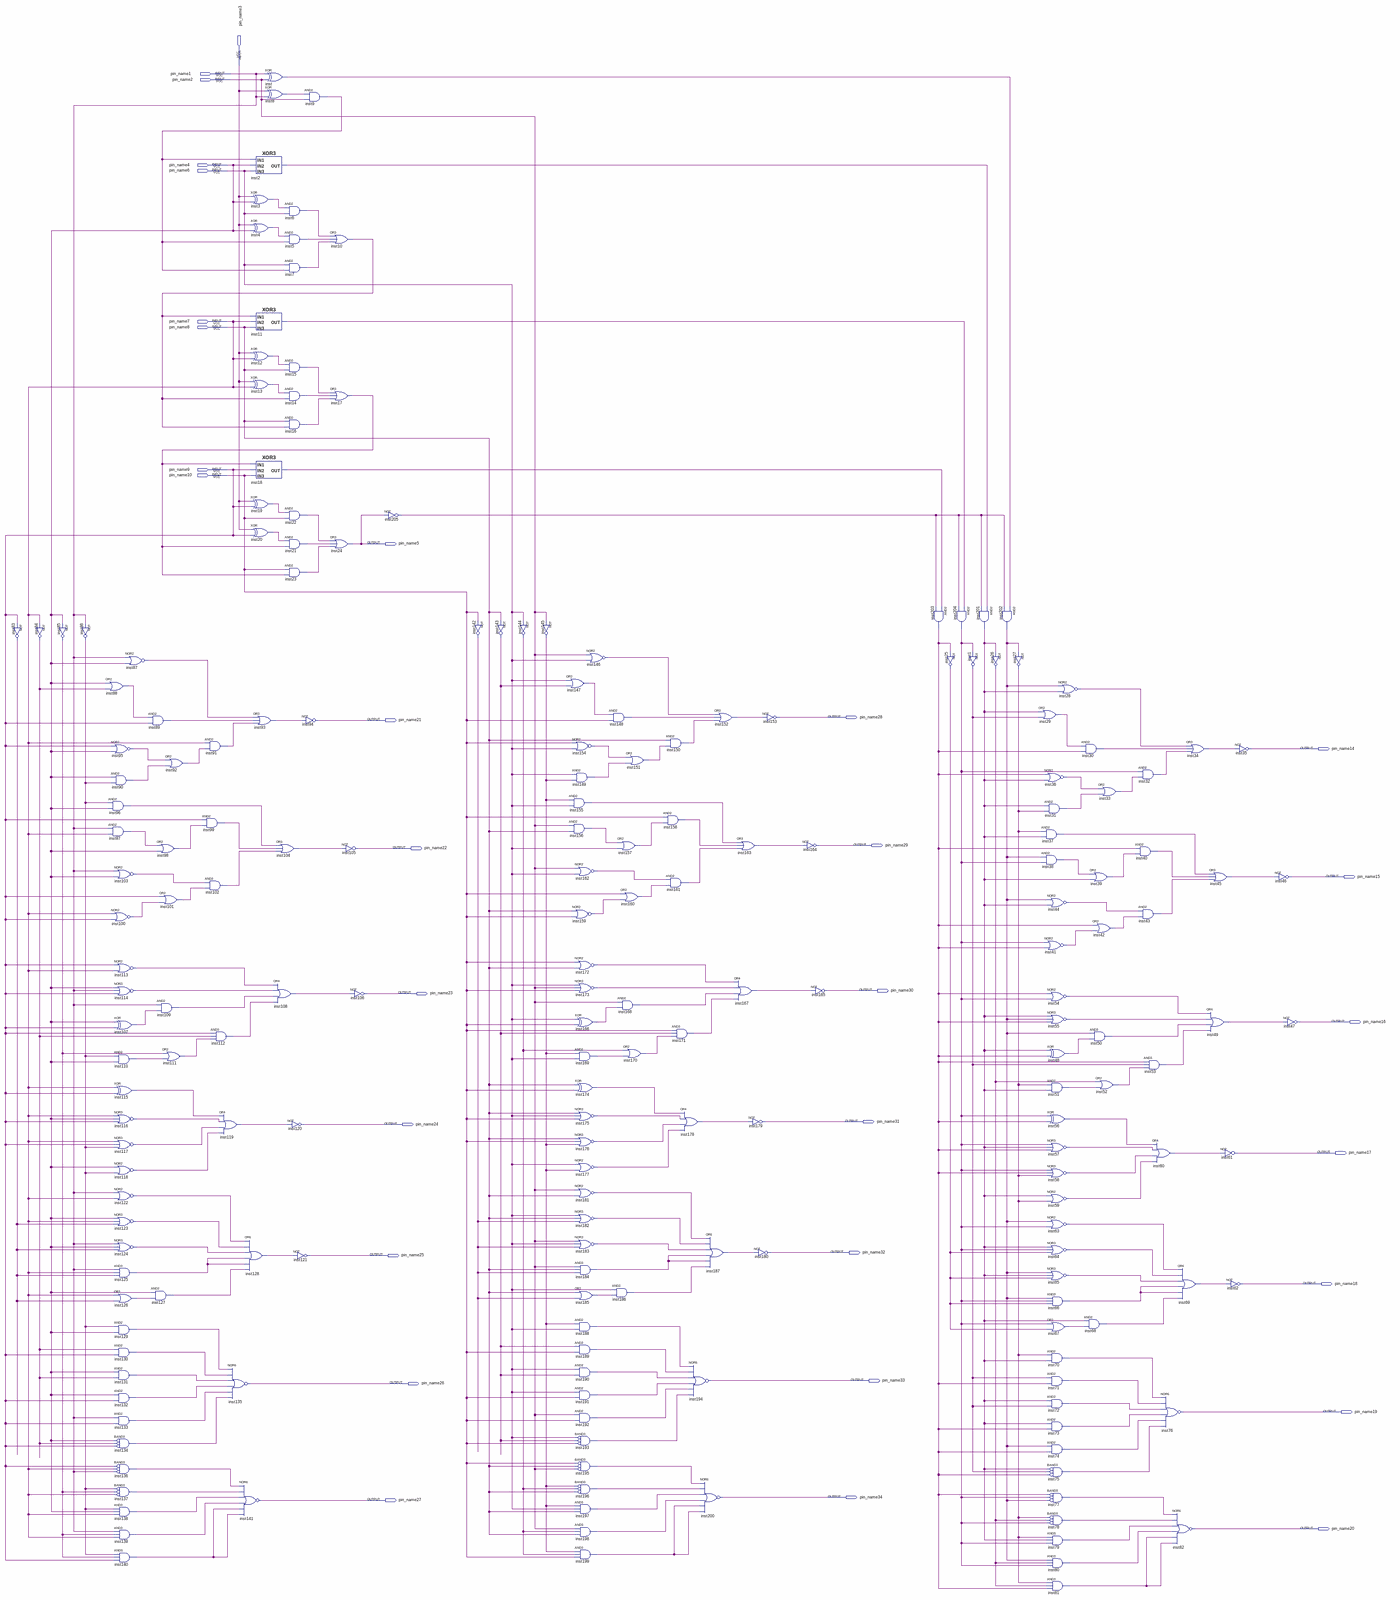
[diagram p0: schematic sheet, whole]
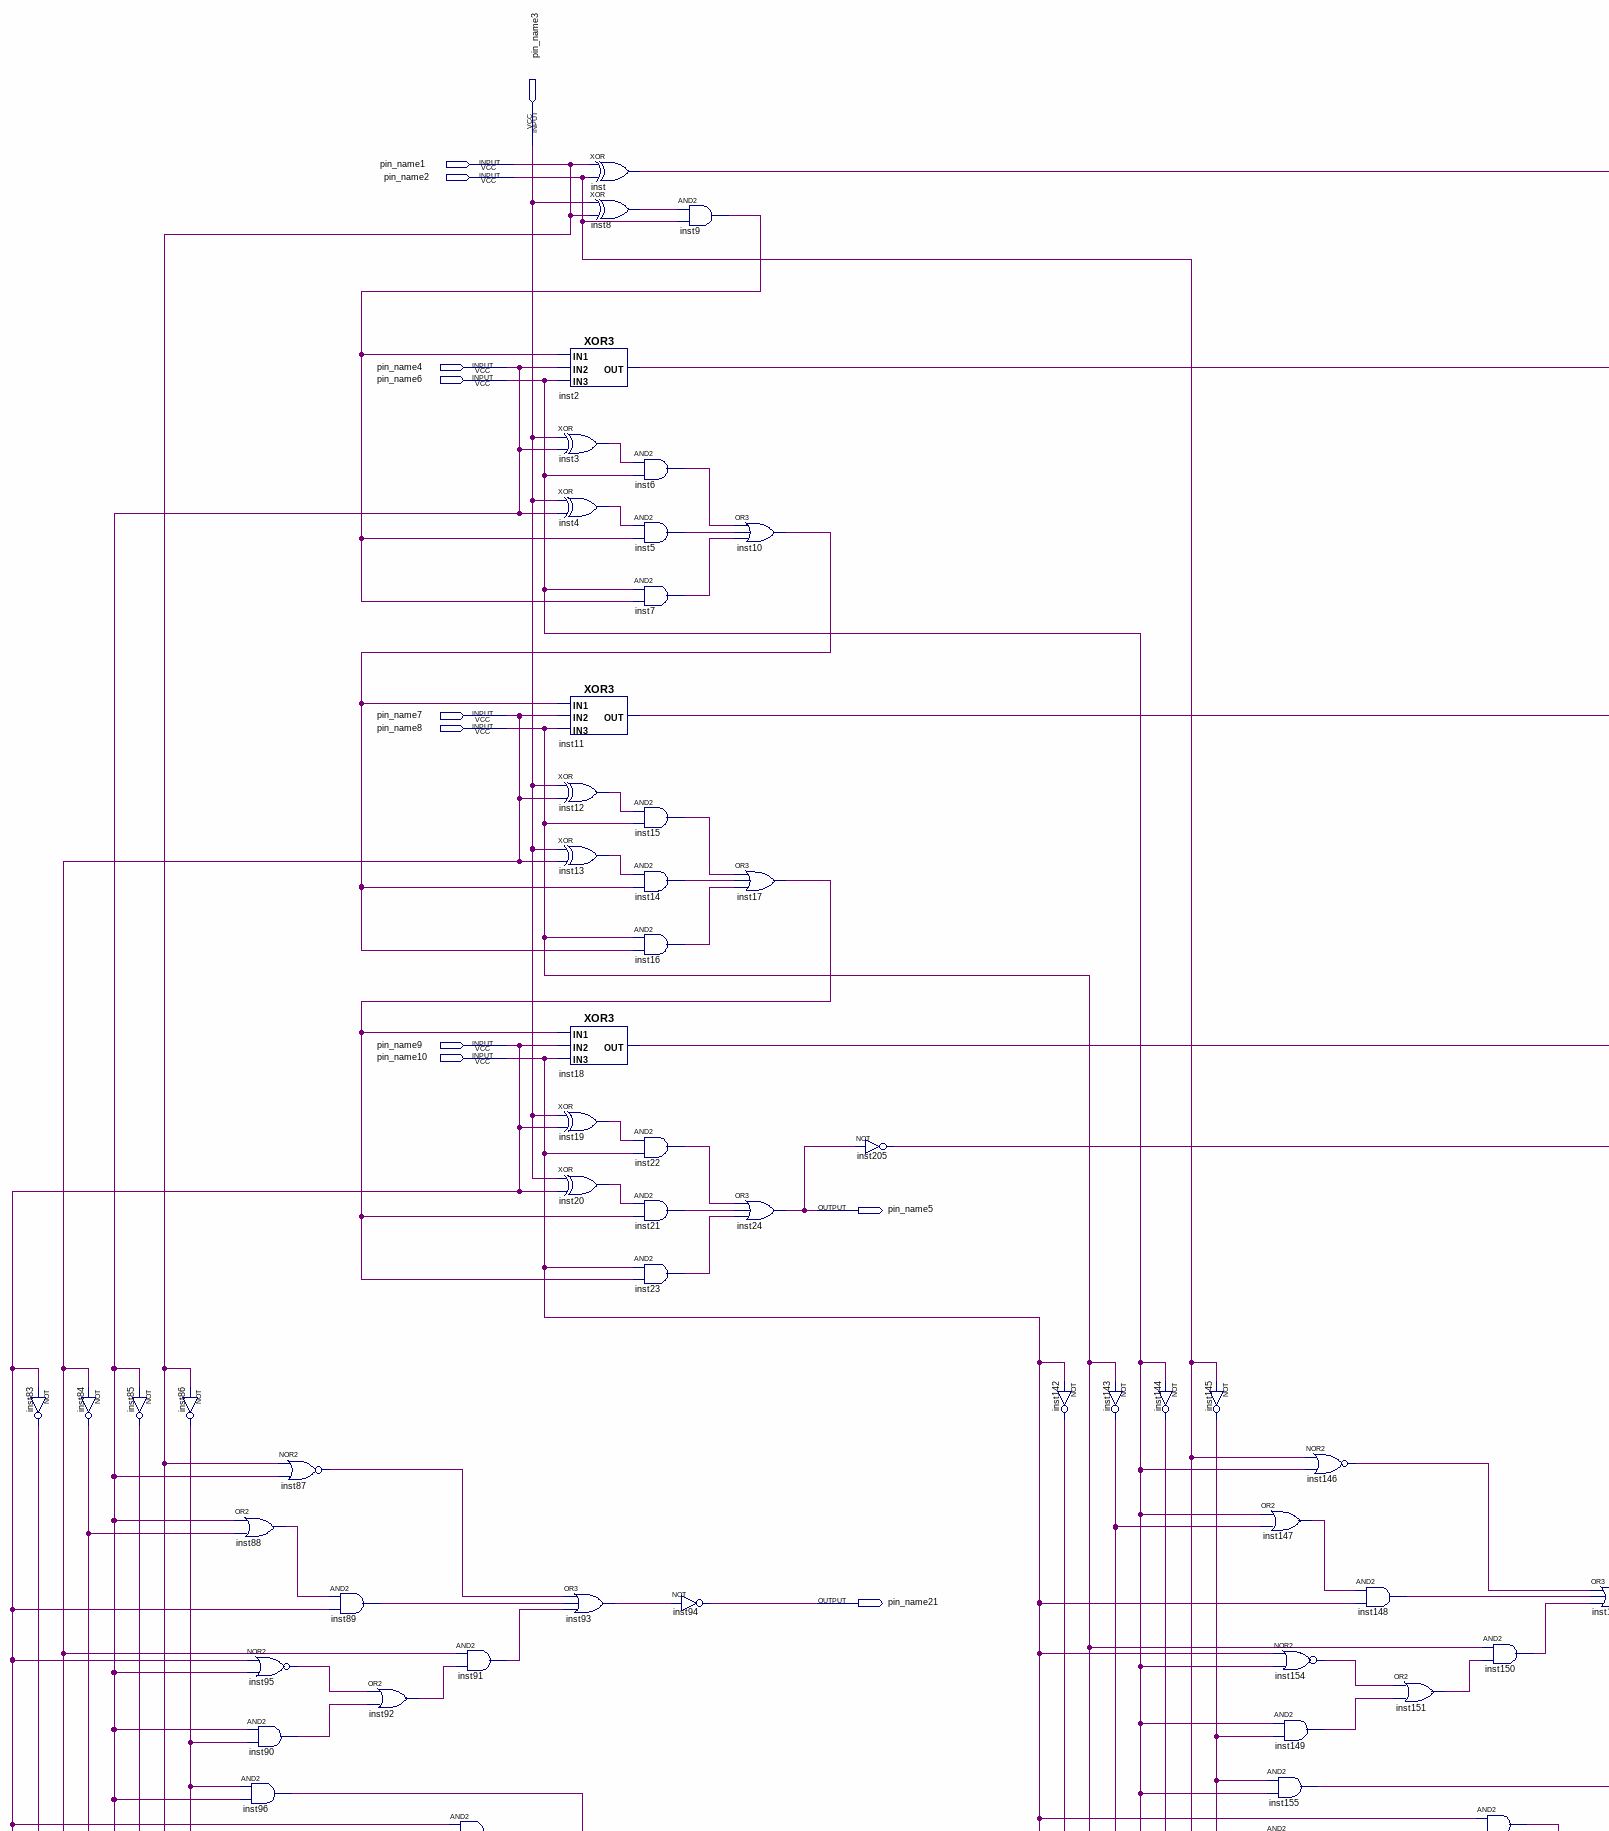
[diagram p1: schematic sheet, upper left part]
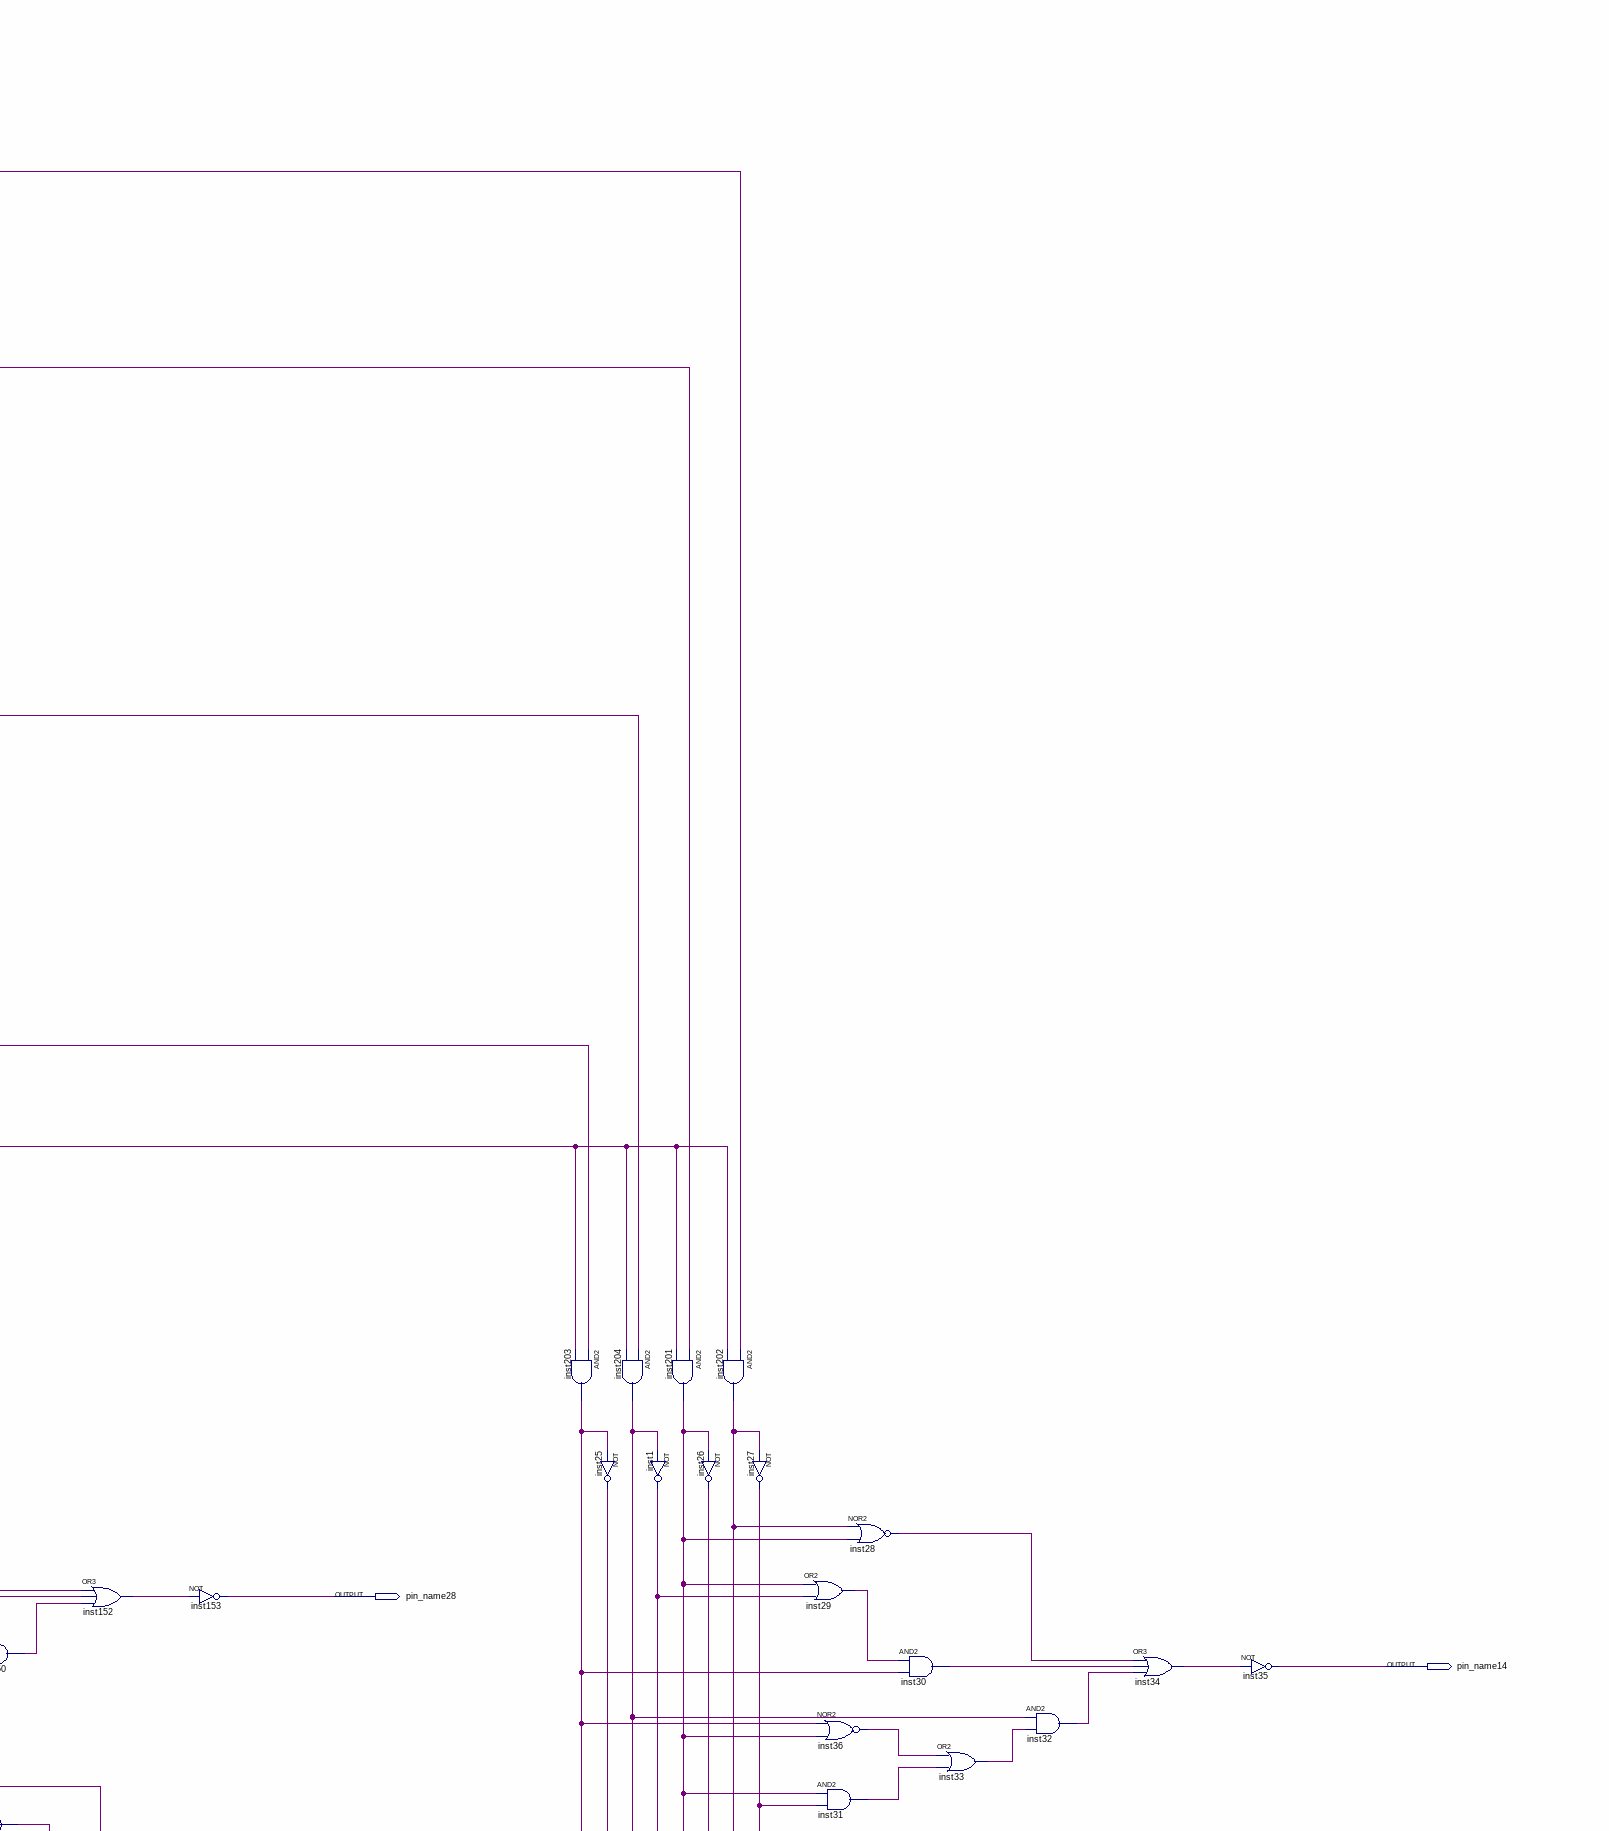
[diagram p2: schematic sheet, upper right part]
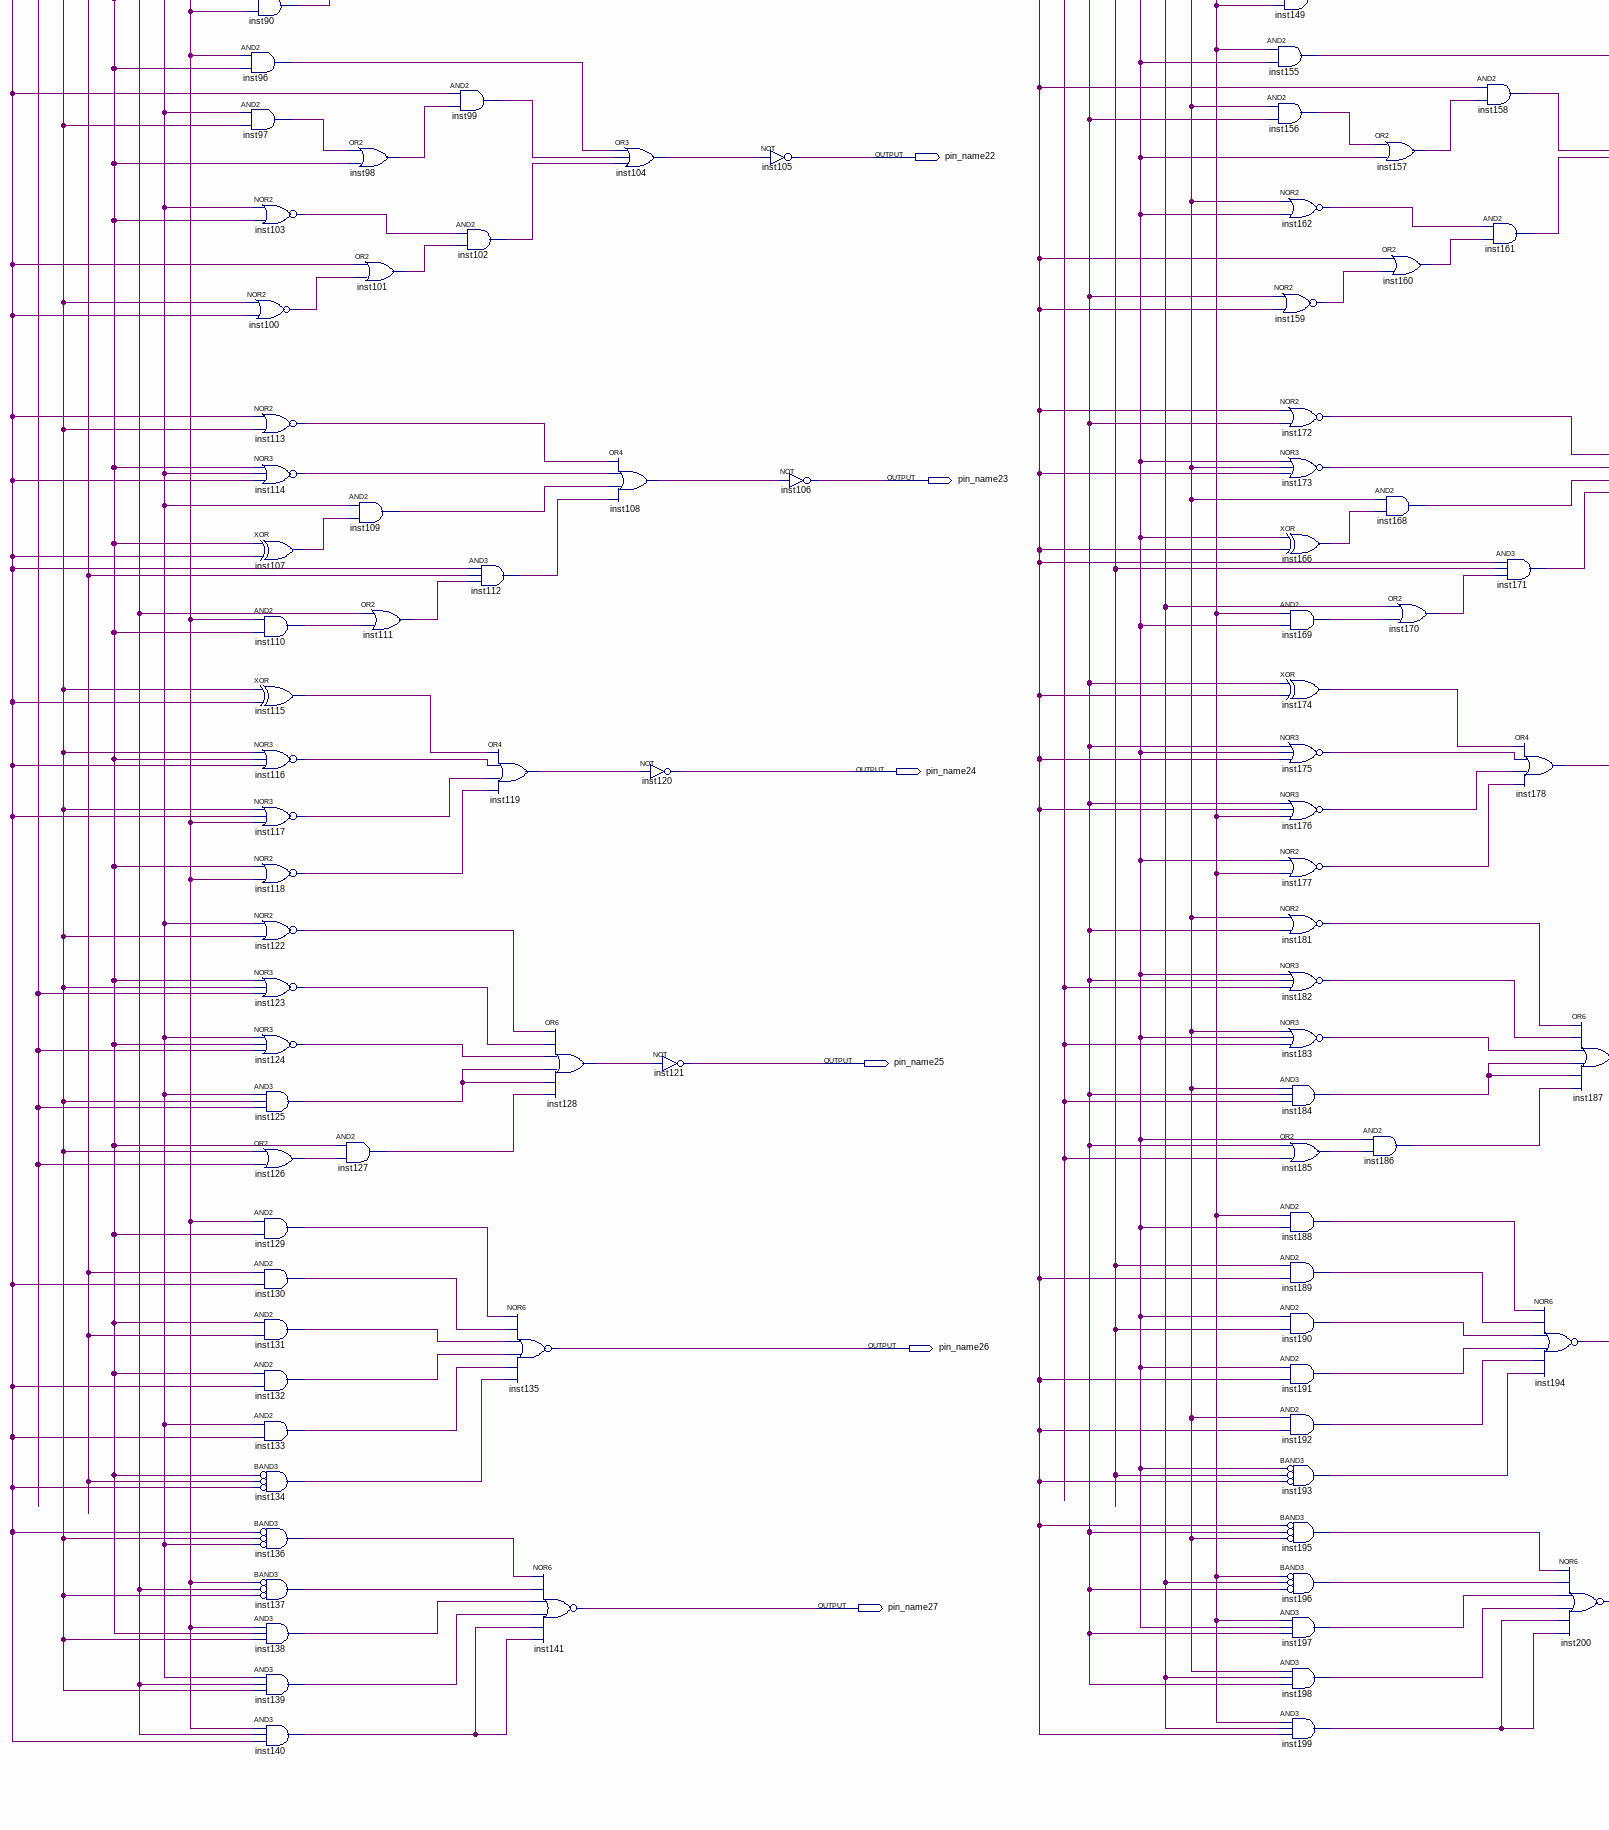
[diagram p3: schematic sheet, lower left part]
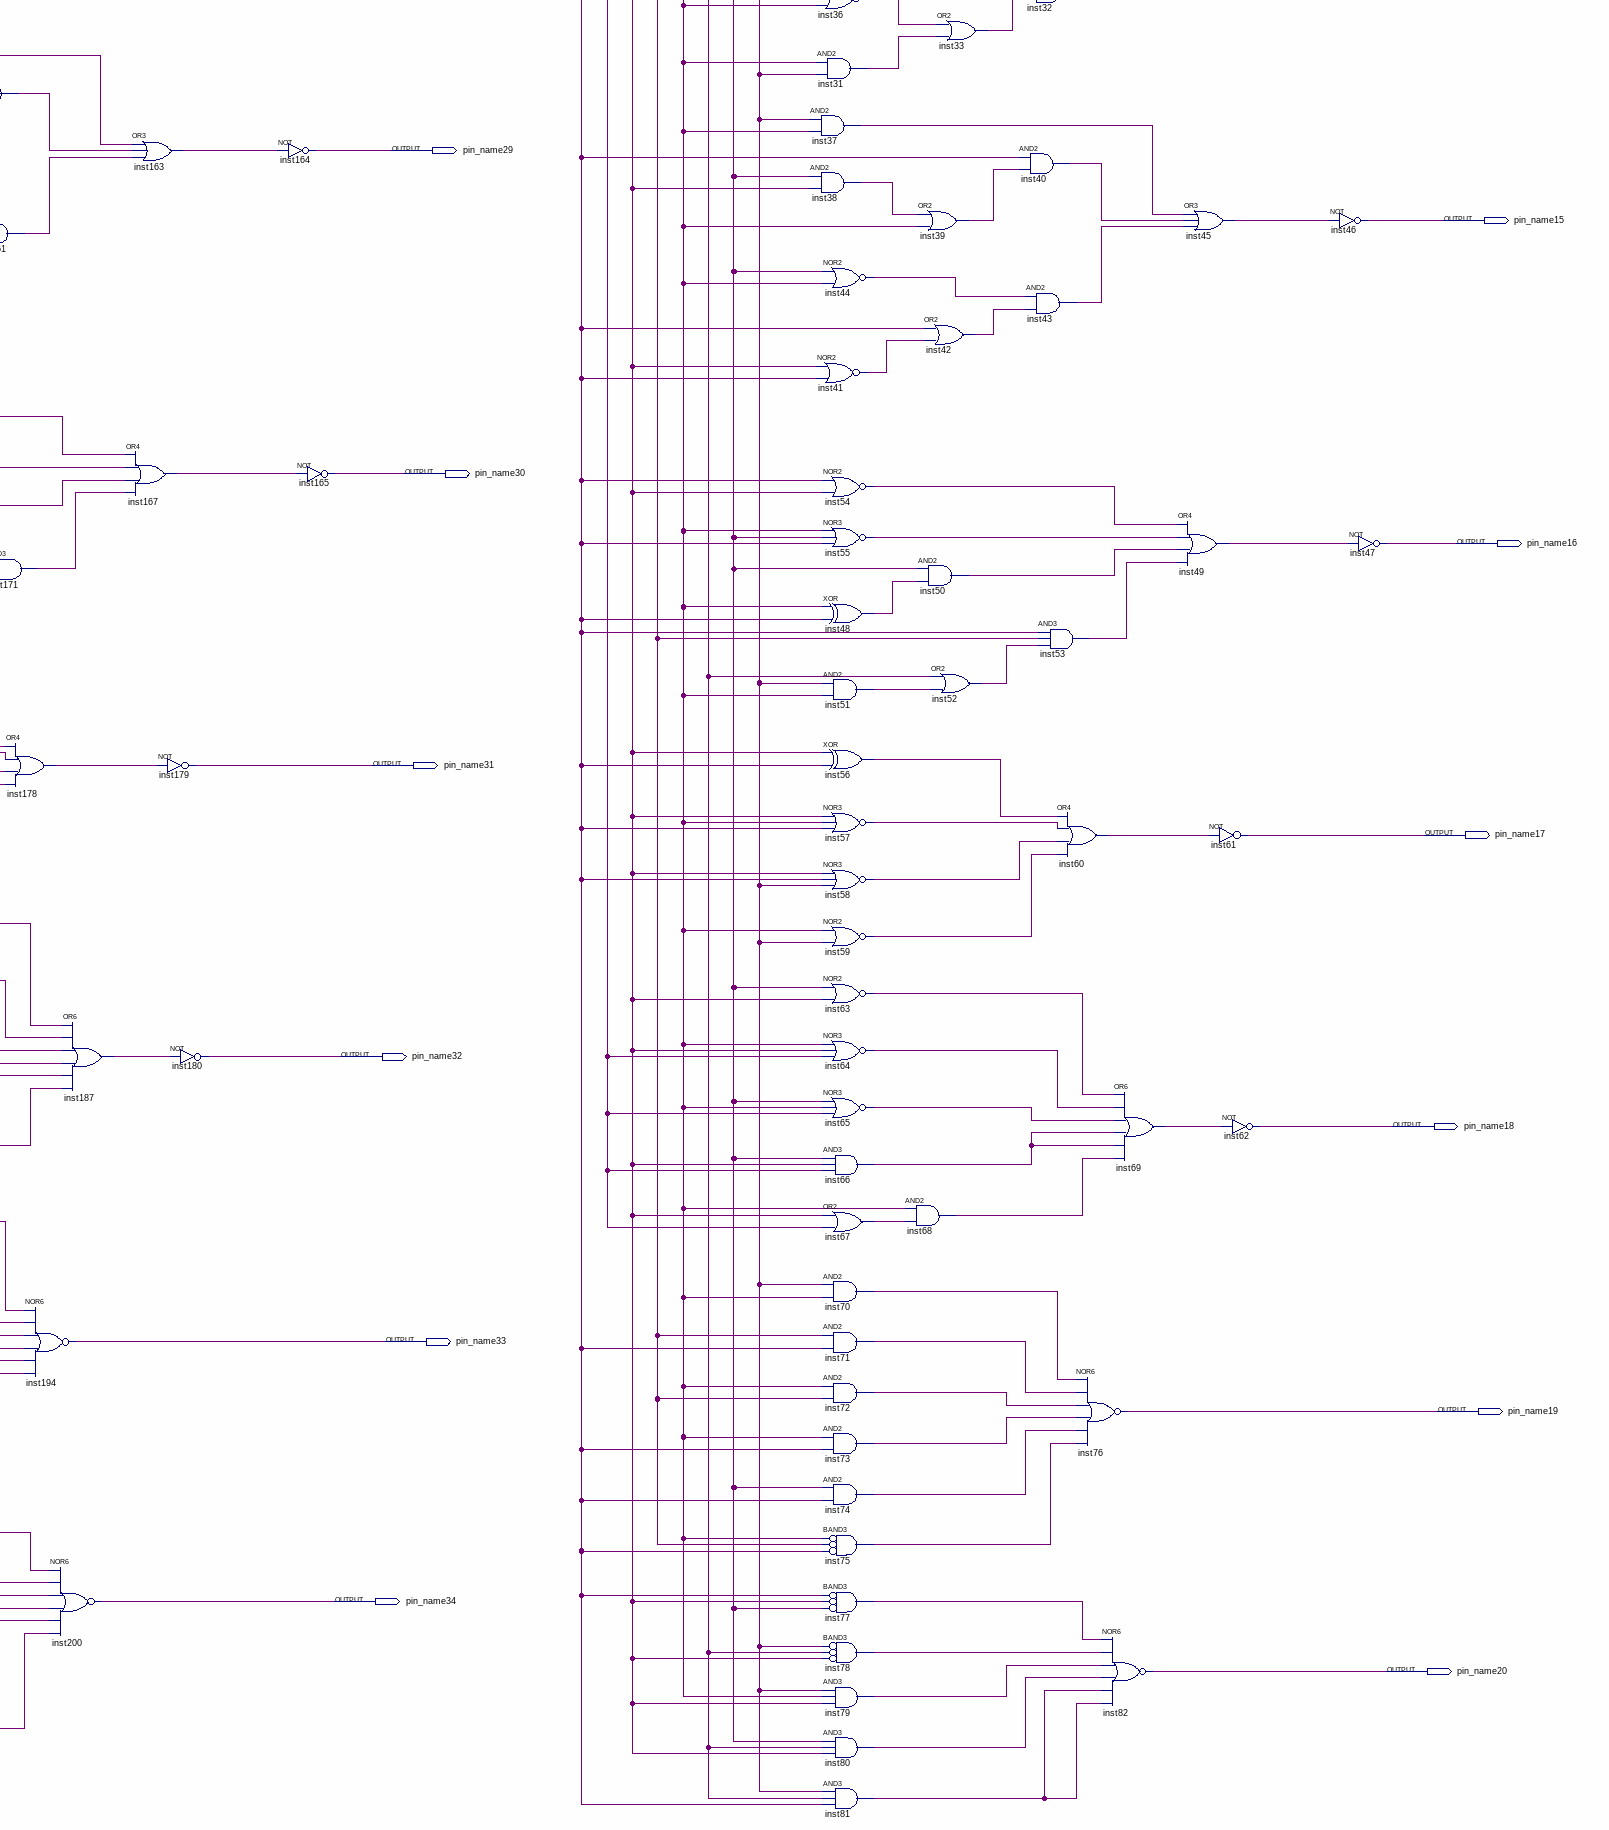
[diagram p4: schematic sheet, lower right part]
// Quartus schematic somador.bdf as structural Verilog: 206 symbols, 31 pins
module somador (
  input  pin_name3,
  input  pin_name1,
  input  pin_name2,
  input  pin_name4,
  input  pin_name6,
  input  pin_name7,
  input  pin_name8,
  input  pin_name9,
  input  pin_name10,
  output pin_name5,
  output pin_name28,
  output pin_name21,
  output pin_name14,
  output pin_name29,
  output pin_name22,
  output pin_name15,
  output pin_name30,
  output pin_name23,
  output pin_name16,
  output pin_name31,
  output pin_name24,
  output pin_name17,
  output pin_name32,
  output pin_name25,
  output pin_name18,
  output pin_name33,
  output pin_name26,
  output pin_name19,
  output pin_name34,
  output pin_name27,
  output pin_name20
);

  wire inst1_out, inst2_out, inst3_out, inst4_out, inst5_out, inst6_out, inst7_out, inst8_out, inst9_out,
       inst10_out, inst11_out, inst12_out, inst13_out, inst14_out, inst15_out, inst16_out, inst17_out,
       inst18_out, inst19_out, inst20_out, inst21_out, inst22_out, inst23_out, inst25_out, inst26_out,
       inst27_out, inst28_out, inst29_out, inst30_out, inst31_out, inst32_out, inst33_out, inst34_out,
       inst36_out, inst37_out, inst38_out, inst39_out, inst40_out, inst41_out, inst42_out, inst43_out,
       inst44_out, inst45_out, inst48_out, inst49_out, inst50_out, inst51_out, inst52_out, inst53_out,
       inst54_out, inst55_out, inst56_out, inst57_out, inst58_out, inst59_out, inst60_out, inst63_out,
       inst64_out, inst65_out, inst66_out, inst67_out, inst68_out, inst69_out, inst70_out, inst71_out,
       inst72_out, inst73_out, inst74_out, inst75_out, inst77_out, inst78_out, inst79_out, inst80_out,
       inst81_out, inst83_out, inst84_out, inst85_out, inst86_out, inst87_out, inst88_out, inst89_out,
       inst90_out, inst91_out, inst92_out, inst93_out, inst95_out, inst96_out, inst97_out, inst98_out,
       inst99_out, inst100_out, inst101_out, inst102_out, inst103_out, inst104_out, inst107_out, inst108_out,
       inst109_out, inst110_out, inst111_out, inst112_out, inst113_out, inst114_out, inst115_out,
       inst116_out, inst117_out, inst118_out, inst119_out, inst122_out, inst123_out, inst124_out,
       inst125_out, inst126_out, inst127_out, inst128_out, inst129_out, inst130_out, inst131_out,
       inst132_out, inst133_out, inst134_out, inst136_out, inst137_out, inst138_out, inst139_out,
       inst140_out, inst142_out, inst143_out, inst144_out, inst145_out, inst146_out, inst147_out,
       inst148_out, inst149_out, inst150_out, inst151_out, inst152_out, inst154_out, inst155_out,
       inst156_out, inst157_out, inst158_out, inst159_out, inst160_out, inst161_out, inst162_out,
       inst163_out, inst166_out, inst167_out, inst168_out, inst169_out, inst170_out, inst171_out,
       inst172_out, inst173_out, inst174_out, inst175_out, inst176_out, inst177_out, inst178_out,
       inst181_out, inst182_out, inst183_out, inst184_out, inst185_out, inst186_out, inst187_out,
       inst188_out, inst189_out, inst190_out, inst191_out, inst192_out, inst193_out, inst195_out,
       inst196_out, inst197_out, inst198_out, inst199_out, inst201_out, inst202_out, inst203_out,
       inst204_out, inst205_out, inst_out;

  not inst83 (inst83_out, pin_name9);
  not inst84 (inst84_out, pin_name7);
  not inst85 (inst85_out, pin_name4);
  not inst86 (inst86_out, pin_name1);
  or inst88 (inst88_out, pin_name4, inst84_out);
  nor inst95 (inst95_out, pin_name9, pin_name4);
  and inst90 (inst90_out, pin_name4, inst86_out);
  and inst96 (inst96_out, inst86_out, pin_name4);
  and inst97 (inst97_out, pin_name1, pin_name7);
  nor inst103 (inst103_out, pin_name1, pin_name4);
  nor inst100 (inst100_out, pin_name7, pin_name9);
  nor inst113 (inst113_out, pin_name9, pin_name7);
  nor inst114 (inst114_out, pin_name4, pin_name1, pin_name9);
  xor inst107 (inst107_out, pin_name4, pin_name9);
  and inst110 (inst110_out, inst86_out, pin_name4);
  xor inst115 (inst115_out, pin_name7, pin_name9);
  nor inst116 (inst116_out, pin_name7, pin_name4, pin_name9);
  nor inst117 (inst117_out, pin_name7, pin_name9, inst86_out);
  nor inst118 (inst118_out, pin_name4, inst86_out);
  nor inst122 (inst122_out, pin_name1, pin_name7);
  nor inst123 (inst123_out, pin_name4, pin_name7, inst83_out);
  nor inst124 (inst124_out, pin_name1, pin_name4, inst83_out);
  and inst125 (inst125_out, pin_name1, pin_name7, inst83_out);
  or inst126 (inst126_out, pin_name7, inst83_out);
  and inst129 (inst129_out, inst86_out, pin_name4);
  and inst130 (inst130_out, inst84_out, pin_name9);
  and inst131 (inst131_out, pin_name4, inst84_out);
  and inst132 (inst132_out, pin_name4, pin_name9);
  and inst133 (inst133_out, pin_name1, pin_name9);
  and inst134 (inst134_out, ~pin_name4, ~inst84_out, ~pin_name9);  // BAND3
  and inst136 (inst136_out, ~pin_name9, ~pin_name7, ~pin_name1);  // BAND3
  and inst137 (inst137_out, ~inst86_out, ~inst85_out, ~pin_name7);  // BAND3
  and inst138 (inst138_out, inst86_out, pin_name4, pin_name7);
  and inst139 (inst139_out, pin_name1, inst85_out, pin_name7);
  and inst140 (inst140_out, inst86_out, inst85_out, pin_name9);
  nor inst87 (inst87_out, pin_name1, pin_name4);
  and inst89 (inst89_out, inst88_out, pin_name9);
  or inst92 (inst92_out, inst95_out, inst90_out);
  or inst98 (inst98_out, inst97_out, pin_name4);
  or inst101 (inst101_out, pin_name9, inst100_out);
  and inst109 (inst109_out, pin_name1, inst107_out);
  or inst111 (inst111_out, inst85_out, inst110_out);
  and inst127 (inst127_out, pin_name4, inst126_out);
  and inst91 (inst91_out, pin_name7, inst92_out);
  and inst99 (inst99_out, pin_name9, inst98_out);
  and inst102 (inst102_out, inst103_out, inst101_out);
  and inst112 (inst112_out, pin_name9, inst84_out, inst111_out);
  or inst119 (inst119_out, inst115_out, inst116_out, inst117_out, inst118_out);
  nor inst135 (pin_name26, inst129_out, inst130_out, inst131_out, inst132_out, inst133_out, inst134_out);
  XOR3 inst2 (.IN3(pin_name6), .IN1(inst9_out), .IN2(pin_name4), .OUT(inst2_out));
  xor inst3 (inst3_out, pin_name3, pin_name4);
  xor inst4 (inst4_out, pin_name3, pin_name4);
  XOR3 inst11 (.IN3(pin_name8), .IN1(inst10_out), .IN2(pin_name7), .OUT(inst11_out));
  xor inst12 (inst12_out, pin_name3, pin_name7);
  xor inst13 (inst13_out, pin_name3, pin_name7);
  XOR3 inst18 (.IN3(pin_name10), .IN1(inst17_out), .IN2(pin_name9), .OUT(inst18_out));
  xor inst19 (inst19_out, pin_name3, pin_name9);
  xor inst20 (inst20_out, pin_name3, pin_name9);
  or inst93 (inst93_out, inst87_out, inst89_out, inst91_out);
  or inst128 (inst128_out, inst122_out, inst123_out, inst124_out, inst125_out, inst125_out, inst127_out);
  nor inst141 (pin_name27, inst136_out, inst137_out, inst138_out, inst139_out, inst140_out, inst140_out);
  xor inst (inst_out, pin_name1, pin_name2);
  xor inst8 (inst8_out, pin_name3, pin_name1);
  or inst104 (inst104_out, inst96_out, inst99_out, inst102_out);
  or inst108 (inst108_out, inst113_out, inst114_out, inst109_out, inst112_out);
  and inst6 (inst6_out, inst3_out, pin_name6);
  and inst5 (inst5_out, inst4_out, inst9_out);
  and inst7 (inst7_out, pin_name6, inst9_out);
  and inst15 (inst15_out, inst12_out, pin_name8);
  and inst14 (inst14_out, inst13_out, inst10_out);
  and inst16 (inst16_out, pin_name8, inst10_out);
  and inst22 (inst22_out, inst19_out, pin_name10);
  and inst21 (inst21_out, inst20_out, inst17_out);
  and inst23 (inst23_out, pin_name10, inst17_out);
  not inst94 (pin_name21, inst93_out);
  not inst120 (pin_name24, inst119_out);
  not inst121 (pin_name25, inst128_out);
  and inst9 (inst9_out, inst8_out, pin_name2);
  or inst10 (inst10_out, inst6_out, inst5_out, inst7_out);
  or inst17 (inst17_out, inst15_out, inst14_out, inst16_out);
  or inst24 (pin_name5, inst22_out, inst21_out, inst23_out);
  not inst105 (pin_name22, inst104_out);
  not inst106 (pin_name23, inst108_out);
  not inst205 (inst205_out, pin_name5);
  not inst142 (inst142_out, pin_name10);
  not inst143 (inst143_out, pin_name8);
  not inst144 (inst144_out, pin_name6);
  not inst145 (inst145_out, pin_name2);
  or inst147 (inst147_out, pin_name6, inst143_out);
  nor inst154 (inst154_out, pin_name10, pin_name6);
  and inst149 (inst149_out, pin_name6, inst145_out);
  and inst155 (inst155_out, inst145_out, pin_name6);
  and inst156 (inst156_out, pin_name2, pin_name8);
  nor inst162 (inst162_out, pin_name2, pin_name6);
  nor inst159 (inst159_out, pin_name8, pin_name10);
  nor inst172 (inst172_out, pin_name10, pin_name8);
  nor inst173 (inst173_out, pin_name6, pin_name2, pin_name10);
  xor inst166 (inst166_out, pin_name6, pin_name10);
  and inst169 (inst169_out, inst145_out, pin_name6);
  xor inst174 (inst174_out, pin_name8, pin_name10);
  nor inst175 (inst175_out, pin_name8, pin_name6, pin_name10);
  nor inst176 (inst176_out, pin_name8, pin_name10, inst145_out);
  nor inst177 (inst177_out, pin_name6, inst145_out);
  nor inst181 (inst181_out, pin_name2, pin_name8);
  nor inst182 (inst182_out, pin_name6, pin_name8, inst142_out);
  nor inst183 (inst183_out, pin_name2, pin_name6, inst142_out);
  and inst184 (inst184_out, pin_name2, pin_name8, inst142_out);
  or inst185 (inst185_out, pin_name8, inst142_out);
  and inst188 (inst188_out, inst145_out, pin_name6);
  and inst189 (inst189_out, inst143_out, pin_name10);
  and inst190 (inst190_out, pin_name6, inst143_out);
  and inst191 (inst191_out, pin_name6, pin_name10);
  and inst192 (inst192_out, pin_name2, pin_name10);
  and inst193 (inst193_out, ~pin_name6, ~inst143_out, ~pin_name10);  // BAND3
  and inst195 (inst195_out, ~pin_name10, ~pin_name8, ~pin_name2);  // BAND3
  and inst196 (inst196_out, ~inst145_out, ~inst144_out, ~pin_name8);  // BAND3
  and inst197 (inst197_out, inst145_out, pin_name6, pin_name8);
  and inst198 (inst198_out, pin_name2, inst144_out, pin_name8);
  and inst199 (inst199_out, inst145_out, inst144_out, pin_name10);
  nor inst146 (inst146_out, pin_name2, pin_name6);
  and inst148 (inst148_out, inst147_out, pin_name10);
  or inst157 (inst157_out, inst156_out, pin_name6);
  or inst160 (inst160_out, pin_name10, inst159_out);
  and inst168 (inst168_out, pin_name2, inst166_out);
  and inst186 (inst186_out, pin_name6, inst185_out);
  or inst151 (inst151_out, inst154_out, inst149_out);
  or inst170 (inst170_out, inst144_out, inst169_out);
  and inst150 (inst150_out, pin_name8, inst151_out);
  and inst158 (inst158_out, pin_name10, inst157_out);
  and inst161 (inst161_out, inst162_out, inst160_out);
  and inst171 (inst171_out, pin_name10, inst143_out, inst170_out);
  or inst178 (inst178_out, inst174_out, inst175_out, inst176_out, inst177_out);
  nor inst194 (pin_name33, inst188_out, inst189_out, inst190_out, inst191_out, inst192_out, inst193_out);
  or inst187 (inst187_out, inst181_out, inst182_out, inst183_out, inst184_out, inst184_out, inst186_out);
  nor inst200 (pin_name34, inst195_out, inst196_out, inst197_out, inst198_out, inst199_out, inst199_out);
  or inst152 (inst152_out, inst146_out, inst148_out, inst150_out);
  or inst167 (inst167_out, inst172_out, inst173_out, inst168_out, inst171_out);
  or inst163 (inst163_out, inst155_out, inst158_out, inst161_out);
  not inst179 (pin_name31, inst178_out);
  not inst180 (pin_name32, inst187_out);
  not inst153 (pin_name28, inst152_out);
  not inst164 (pin_name29, inst163_out);
  not inst165 (pin_name30, inst167_out);
  and inst203 (inst203_out, inst18_out, inst205_out);
  and inst204 (inst204_out, inst11_out, inst205_out);
  not inst25 (inst25_out, inst203_out);
  and inst201 (inst201_out, inst2_out, inst205_out);
  not inst1 (inst1_out, inst204_out);
  and inst202 (inst202_out, inst_out, inst205_out);
  not inst26 (inst26_out, inst201_out);
  not inst27 (inst27_out, inst202_out);
  or inst29 (inst29_out, inst201_out, inst1_out);
  nor inst36 (inst36_out, inst203_out, inst201_out);
  and inst31 (inst31_out, inst201_out, inst27_out);
  and inst37 (inst37_out, inst27_out, inst201_out);
  and inst38 (inst38_out, inst202_out, inst204_out);
  nor inst44 (inst44_out, inst202_out, inst201_out);
  nor inst41 (inst41_out, inst204_out, inst203_out);
  nor inst54 (inst54_out, inst203_out, inst204_out);
  nor inst55 (inst55_out, inst201_out, inst202_out, inst203_out);
  xor inst48 (inst48_out, inst201_out, inst203_out);
  and inst51 (inst51_out, inst27_out, inst201_out);
  xor inst56 (inst56_out, inst204_out, inst203_out);
  nor inst57 (inst57_out, inst204_out, inst201_out, inst203_out);
  nor inst58 (inst58_out, inst204_out, inst203_out, inst27_out);
  nor inst59 (inst59_out, inst201_out, inst27_out);
  nor inst63 (inst63_out, inst202_out, inst204_out);
  nor inst64 (inst64_out, inst201_out, inst204_out, inst25_out);
  nor inst65 (inst65_out, inst202_out, inst201_out, inst25_out);
  and inst66 (inst66_out, inst202_out, inst204_out, inst25_out);
  or inst67 (inst67_out, inst204_out, inst25_out);
  and inst70 (inst70_out, inst27_out, inst201_out);
  and inst71 (inst71_out, inst1_out, inst203_out);
  and inst72 (inst72_out, inst201_out, inst1_out);
  and inst73 (inst73_out, inst201_out, inst203_out);
  and inst74 (inst74_out, inst202_out, inst203_out);
  and inst75 (inst75_out, ~inst201_out, ~inst1_out, ~inst203_out);  // BAND3
  and inst77 (inst77_out, ~inst203_out, ~inst204_out, ~inst202_out);  // BAND3
  and inst78 (inst78_out, ~inst27_out, ~inst26_out, ~inst204_out);  // BAND3
  and inst79 (inst79_out, inst27_out, inst201_out, inst204_out);
  and inst80 (inst80_out, inst202_out, inst26_out, inst204_out);
  and inst81 (inst81_out, inst27_out, inst26_out, inst203_out);
  nor inst28 (inst28_out, inst202_out, inst201_out);
  and inst30 (inst30_out, inst29_out, inst203_out);
  or inst33 (inst33_out, inst36_out, inst31_out);
  or inst39 (inst39_out, inst38_out, inst201_out);
  or inst42 (inst42_out, inst203_out, inst41_out);
  and inst50 (inst50_out, inst202_out, inst48_out);
  or inst52 (inst52_out, inst26_out, inst51_out);
  and inst68 (inst68_out, inst201_out, inst67_out);
  and inst32 (inst32_out, inst204_out, inst33_out);
  and inst40 (inst40_out, inst203_out, inst39_out);
  and inst43 (inst43_out, inst44_out, inst42_out);
  and inst53 (inst53_out, inst203_out, inst1_out, inst52_out);
  or inst60 (inst60_out, inst56_out, inst57_out, inst58_out, inst59_out);
  nor inst76 (pin_name19, inst70_out, inst71_out, inst72_out, inst73_out, inst74_out, inst75_out);
  or inst34 (inst34_out, inst28_out, inst30_out, inst32_out);
  or inst69 (inst69_out, inst63_out, inst64_out, inst65_out, inst66_out, inst66_out, inst68_out);
  nor inst82 (pin_name20, inst77_out, inst78_out, inst79_out, inst80_out, inst81_out, inst81_out);
  or inst45 (inst45_out, inst37_out, inst40_out, inst43_out);
  or inst49 (inst49_out, inst54_out, inst55_out, inst50_out, inst53_out);
  not inst35 (pin_name14, inst34_out);
  not inst61 (pin_name17, inst60_out);
  not inst62 (pin_name18, inst69_out);
  not inst46 (pin_name15, inst45_out);
  not inst47 (pin_name16, inst49_out);
endmodule
